# EAGLE design main_board (EAGLE 7.7.0)
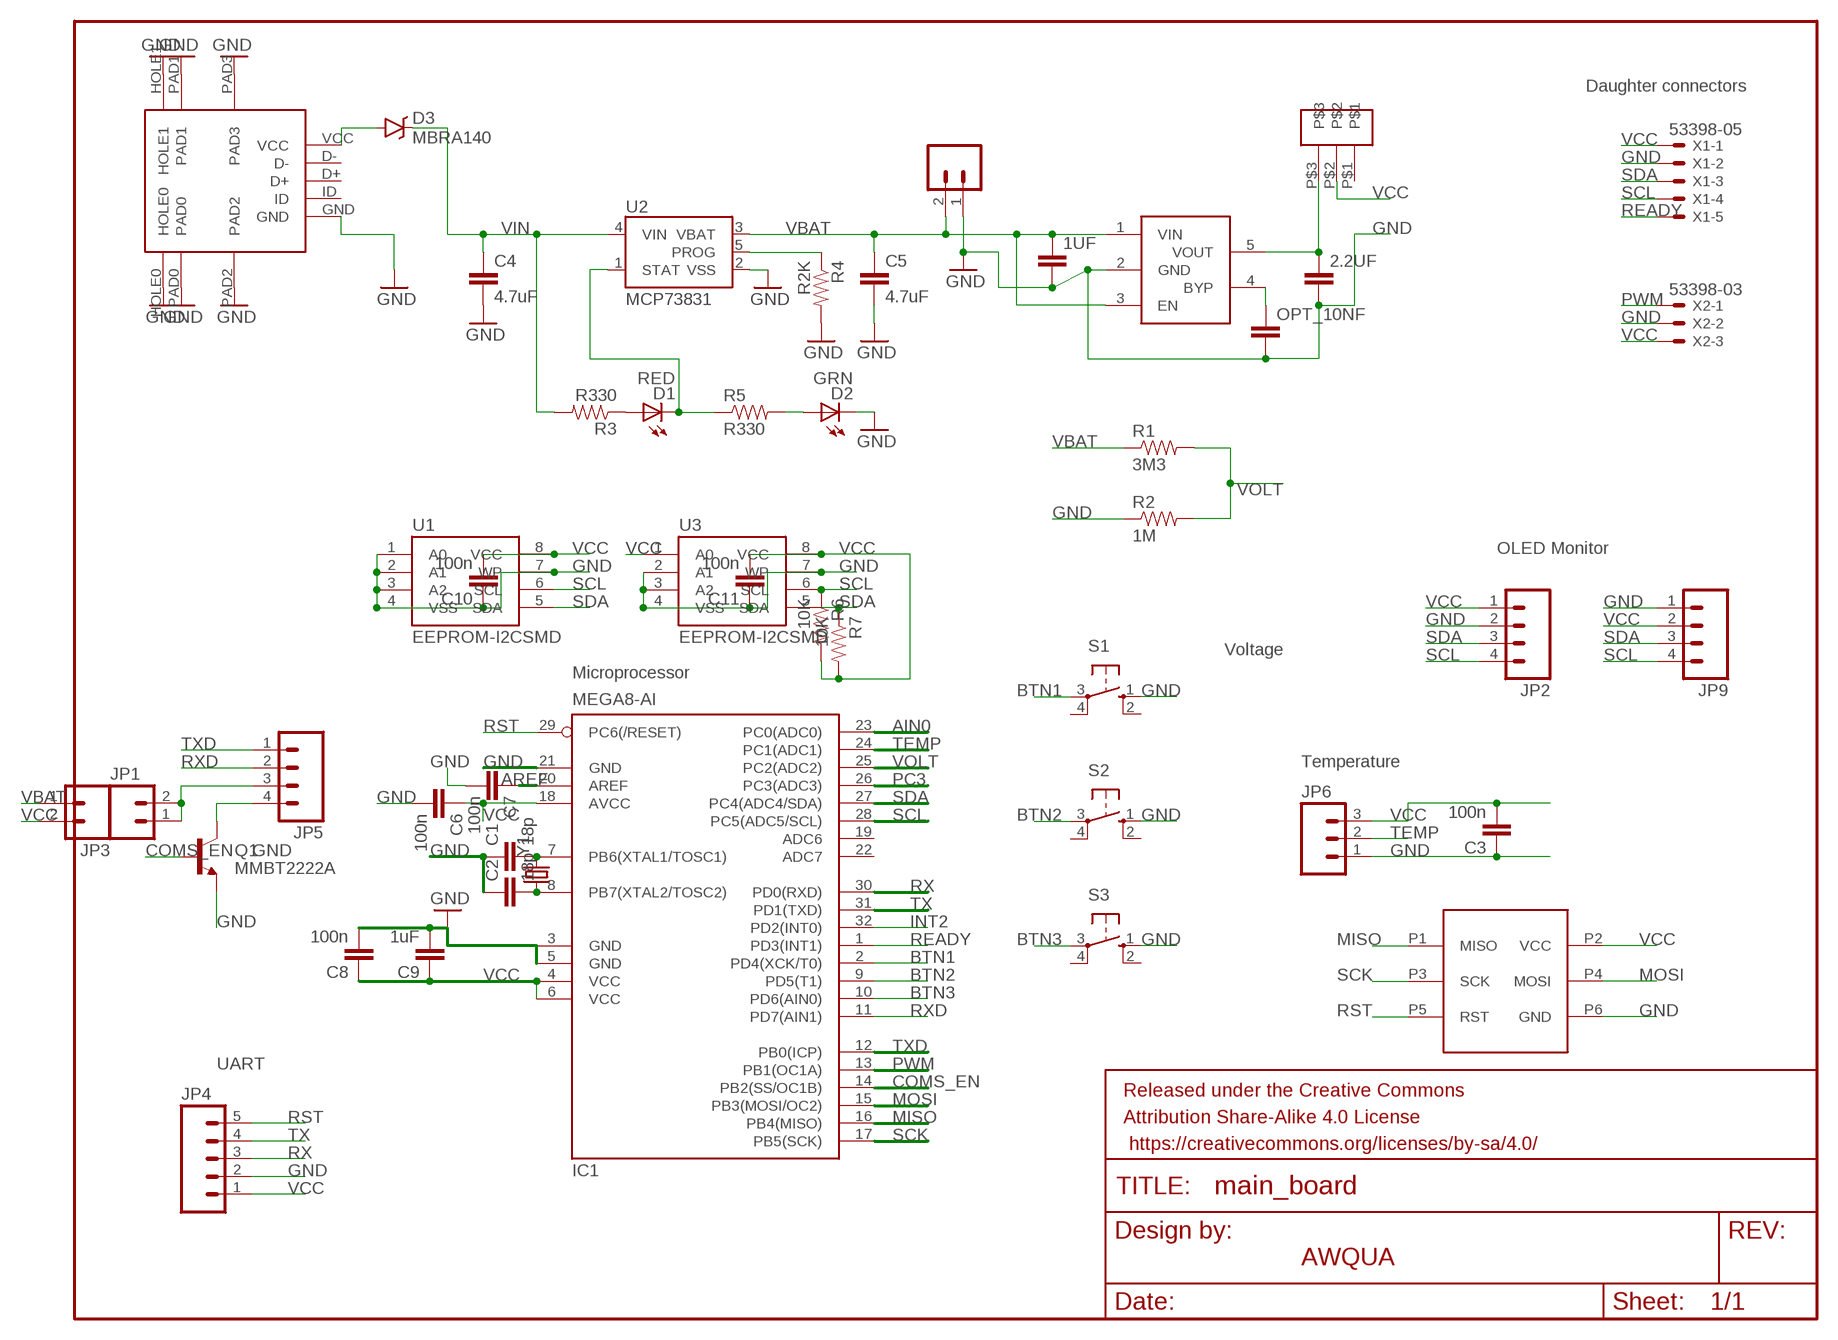
[diagram p0: schematic, sheet 1]

## Parts
1UF  CAP0603-CAP  [0603-CAP]
2.2UF  CAP0603-CAP  [0603-CAP]
C1  18p  CAP0603-CAP  [0603-CAP]
C2  18p  CAP0603-CAP  [0603-CAP]
C3  100n  CAP0603-CAP  [0603-CAP]
C4  4.7uF  CAP0402-CAP  [0402-CAP]
C5  4.7uF  CAP0402-CAP  [0402-CAP]
C6  100n  CAP0603-CAP  [0603-CAP]
C7  100n  CAP0603-CAP  [0603-CAP]
C8  100n  CAP0603-CAP  [0603-CAP]
C9  1uF  CAP0603-CAP  [0603-CAP]
C10  100n  CAP0603-CAP  [0603-CAP]
C11  100n  CAP0603-CAP  [0603-CAP]
D1  RED  LED0603  [LED-0603]
D2  GRN  LED0603  [LED-0603]
D3  MBRA140  [SMA-DIODE]
FRAME1  FRAME-LETTER  [CREATIVE_COMMONS]
IC1  MEGA8-AI  [TQFP32-08]
JP1  M02PTH  [1X02]
JP2  M04PTH  [1X04]
JP3  M02PTH  [1X02]
JP4  M05PTH  [1X05]
JP5  M04PTH  [1X04]
JP6  M03PTH  [1X03]
JP7  LiPo Battery  M02-JST-2MM-SMT  [JST-2-SMD]
JP9  M04PTH  [1X04]
OPT_10NF  CAP0603-CAP  [0603-CAP]
Q1  MMBT2222A  TRANSISTOR_NPNMMBT2222A  [SOT23-3]
R1  3M3  RESISTOR0603  [0603-RES]
R2  1M  RESISTOR0603  [0603-RES]
R3  R330  RESISTOR0402-RES  [0402-RES]
R4  R2K  RESISTOR0402-RES  [0402-RES]
R5  R330  RESISTOR0402-RES  [0402-RES]
R6  10K  RESISTOR0402-RES  [0402-RES]
R7  10K  RESISTOR0402-RES  [0402-RES]
S1  40-XX  [B3F-40XX]
S2  40-XX  [B3F-40XX]
S3  40-XX  [B3F-40XX]
U1  EEPROM-I2CSMD  [SO08]
U2  MCP73831  [SOT23-5]
U3  EEPROM-I2CSMD  [SO08]
U$1  ISP-SMD-6PIN  [ISP-SMD-6PIN]
U$2  OS102-SPDT-SWITCH  [OS102-SPDT-SWITCH]
U$3  USBMICRO-10118193-0001LF  [USBMICRO-10118193-0001LF]
U$6  LP2985  [LP2985]
X1  53398-05  [53398-05]
X2  53398-03  [53398-03]
Y1  CRYSTAL5X3  [CRYSTAL-SMD-5X3]

## Nets
AIN0: IC1.23(PC0(ADC0))
AREF: C7.1 IC1.20(AREF)
BTN1: IC1.2(PD4(XCK/T0)) S1.3(P)
BTN2: IC1.9(PD5(T1)) S2.3(P)
BTN3: IC1.10(PD6(AIN0)) S3.3(P)
COMS_EN: IC1.14(PB2(SS/OC1B)) Q1.1(B)
GND: 1UF.2 2.2UF.2 C1.1 C2.1 C3.1 C4.2 C5.2 C6.2 C7.2 C8.2 C9.2 C10.1 C11.1 D2.C IC1.3(GND) IC1.5(GND) IC1.21(GND) JP2.2 JP4.2 JP5.4 JP6.1 JP7.1 JP9.1 OPT_10NF.2 Q1.2(E) Q1.3(C) R2.1 R4.2 S1.1(S) S2.1(S) S3.1(S) U1.1(A0) U1.2(A1) U1.3(A2) U1.4(VSS) U1.7(WP) U2.2(VSS) U3.2(A1) U3.3(A2) U3.4(VSS) U3.7(WP) U$1.P6(GND) U$3.GND U$3.HOLE0 U$3.HOLE1 U$3.PAD0 U$3.PAD1 U$3.PAD2 U$3.PAD3 U$6.2(GND) X1.2 X2.2
INT2: IC1.32(PD2(INT0))
MISO: IC1.16(PB4(MISO)) U$1.P1(MISO)
MOSI: IC1.15(PB3(MOSI/OC2)) U$1.P4(MOSI)
N$1: D1.A R3.1
N$2: OPT_10NF.1 U$6.4(BYP)
N$3: JP1.1 JP1.2 JP5.3
N$4: 2.2UF.1 U$2.P$3 U$6.5(VOUT)
N$5: D2.A R5.2
PC3: IC1.26(PC3(ADC3))
PROG: R4.1 U2.5(PROG)
PWM: IC1.13(PB1(OC1A)) X2.1
Q1: C2.2 IC1.8(PB7(XTAL2/TOSC2)) Y1.1
Q2: C1.2 IC1.7(PB6(XTAL1/TOSC1)) Y1.3
READY: IC1.1(PD3(INT1)) X1.5
RST: IC1.29(PC6(/RESET)) JP4.5 U$1.P5(RST)
RX: IC1.30(PD0(RXD)) JP4.3
RXD: IC1.11(PD7(AIN1)) JP5.2
SCK: IC1.17(PB5(SCK)) U$1.P3(SCK)
SCL: IC1.28(PC5(ADC5/SCL)) JP2.4 JP9.4 R6.1 U1.6(SCL) U3.6(SCL) X1.4
SDA: IC1.27(PC4(ADC4/SDA)) JP2.3 JP9.3 R7.1 U1.5(SDA) U3.5(SDA) X1.3
STAT: D1.C R5.1 U2.1(STAT)
TEMP: IC1.24(PC1(ADC1)) JP6.2
TX: IC1.31(PD1(TXD)) JP4.4
TXD: IC1.12(PB0(ICP)) JP5.1
VBAT: 1UF.1 C5.1 JP3.1 JP7.2 R1.1 U2.3(VBAT) U$6.1(VIN) U$6.3(EN)
VBUS: D3.A U$3.VCC
VCC: C3.2 C6.1 C8.1 C9.1 C10.2 C11.2 IC1.4(VCC) IC1.6(VCC) IC1.18(AVCC) JP2.1 JP3.2 JP4.1 JP6.3 JP9.2 R6.2 R7.2 U1.8(VCC) U3.1(A0) U3.8(VCC) U$1.P2(VCC) U$2.P$2 X1.1 X2.3
VIN: C4.1 D3.C R3.2 U2.4(VIN)
VOLT: IC1.25(PC2(ADC2)) R1.2 R2.2
Unconnected: IC1.19(ADC6) IC1.22(ADC7) S1.2(S1) S1.4(P1) S2.2(S1) S2.4(P1) S3.2(S1) S3.4(P1) U$2.P$1 U$3.D+ U$3.D- U$3.ID

## Notes on the sheet
- Daughter connectors
- OLED Monitor
- Voltage
- Microprocessor
- Temperature
- UART
- AWQUA

## Library data of the parts
1UF 2.2UF OPT_10NF = SparkFun-Passives:CAP: Capacitor Standard 0603 ceramic capacitor, and 0.1" leaded capacitor.
C1-C11 = SparkFun:CAP: Capacitor Standard 0603 ceramic capacitor, and 0.1" leaded capacitor.
D1 D2 = SparkFun:LED: LEDs Standard schematic elements and footprints for 5mm, 3mm, 1206, and 0603 sized LEDs. 5mm - Spark Fun Electronics SKU : COM-00529 (and others)
D3 = SparkFun-DiscreteSemi:MBRA140: 40V, 1A Schottky rectifier SMA/DO-214AC package DIO-08053; PROD_ID: DIO-08053
FRAME1 = SparkFun-Aesthetics:FRAME-LETTER: Schematic Frame Standard 8.5x11 US Letter frame
IC1 = atmel:MEGA8: MICROCONTROLLER 8 Kbytes FLASH, 1 kbytes SRAM, 512 bytes EEPROM, USART, 6-channel 10 bit ADC, 2-channel 8 bit ADC Pin compatible with Atmega48, ATMega88, ATMega168 Source: avr.lbr; MPN: ATMEGA8-16AU; OC_FARNELL: 9171371; OC_NEWARK: 73M8863
JP1 JP3 = SparkFun-Connectors:M02: Standard 2-pin 0.1" header. Use with - straight break away headers ( PRT-00116) - right angle break away headers (PRT-00553) - swiss pins (PRT-00743) - machine pins (PRT-00117) - female headers (PRT-00115) Molex polarized connector foot print use with: PRT-08233 with associated crimp pins and housings. 2.54_SCREWTERM for use with PRT-10571. 3.5mm Screw Terminal footprints for PRT-08084 5mm Screw Terminal footprints for use with PRT-08432
JP2 JP5 JP9 = SparkFun-Connectors:M04: Header 4 Standard 4-pin 0.1" header. Use with straight break away headers (SKU : PRT-00116), right angle break away headers (PRT-00553), swiss pins (PRT-00743), machine pins (PRT-00117), and female headers (PRT-00115). Molex polarized connector foot print use with SKU : PRT-08231 with associated crimp pins and housings. 1MM SMD Version SKU: PRT-10208
JP4 = SparkFun-Connectors:M05: Header 5 Standard 5-pin 0.1" header. Use with straight break away headers (SKU : PRT-00116), right angle break away headers (PRT-00553), swiss pins (PRT-00743), machine pins (PRT-00117), and female headers (PRT-00115). Molex polarized connector foot print use with SKU : PRT-08230 with associated crimp pins and housings.
JP6 = SparkFun-Connectors:M03: Header 3 Standard 3-pin 0.1" header. Use with straight break away headers (SKU : PRT-00116), right angle break away headers (PRT-00553), swiss pins (PRT-00743), machine pins (PRT-00117), and female headers (PRT-00115). Molex polarized connector foot print use with SKU : PRT-08232 with associated crimp pins and housings.
JP7 = SparkFun:M02: Header 2 Standard 2-pin 0.1" header. Use with straight break away headers (SKU : PRT-00116), right angle break away headers (PRT-00553), swiss pins (PRT-00743), machine pins (PRT-00117), and female headers (PRT-00115). Molex polarized connector foot print use with SKU : PRT-08233 with associated crimp pins and housings.
Q1 = SparkFun-DiscreteSemi:TRANSISTOR_NPN: Generic NPN BJT MMBT2222A - TRANS-08049 (SOT-23, 1A 40V) MPSA42 - TRANS-09116 (SOT-23, 500mA 300V) MMBT5088LT1G - TRANS-11160 (SOT-23, 50 mA 30V) BC547 - COM-08928 <http://www.sparkfun.com/products/8928> (TO-92 45V 100mA) (1.Collector 2.Base 3.Emitter) 2N3904 - COM-00521 <http://www.sparkfun.com/products/521> (TO-92 40V 200mA) (1.Emitter 2.Base 3.Collector) P2N2222A - COM-12852 <http://www.sparkfun.com/products/12852> (TO-92 40V 600mA) (1.Collector 2.Base 3.Emitter); PROD_ID: TRANS-08049
R1 R2 = SparkFun-Resistors:RESISTOR: Resistor Basic schematic elements and footprints for 0603, 1206, and PTH resistors.
R3-R7 = SparkFun:RESISTOR: Resistor Basic schematic elements and footprints for 0603, 1206, and PTH resistors.
S1-S3 = adafruit:40-XX: OMRON SWITCH; MF: OMRON COMPONENTS USA; MPN: B3F-4000; OC_FARNELL: 176434; OC_NEWARK: 36K3105
U1 U3 = SparkFun-DigitalIC:EEPROM-I2C: I2C EEPROM chips, 24LC256 (and others)
U2 = SparkFun:MCP73831: Microchip's MCP73831 Miniature single cell, fully integrated Li-Ion, Li-polymer charge management controller http://ww1.microchip.com/downloads/en/DeviceDoc/21984a.pdf
U$1 = awqua_eagle_library:ISP-SMD-6PIN
U$2 = awqua_eagle_library:OS102-SPDT-SWITCH
U$3 = awqua_eagle_library:USBMICRO-10118193-0001LF
U$6 = awqua_eagle_library:LP2985
X1 = con-molex:53?-05: CONNECTOR wire to board 1.25 mm (.049 inch) pitch header; OC_FARNELL: 1125354; OC_NEWARK: unknown
X2 = con-molex:53?-03: CONNECTOR wire to board 1.25 mm (.049 inch) pitch header; OC_FARNELL: unknown; OC_NEWARK: unknown
Y1 = SparkFun:CRYSTAL: Crystals Various standard crystals. Proven footprints. Spark Fun Electronics SKU : COM-00534

## Board
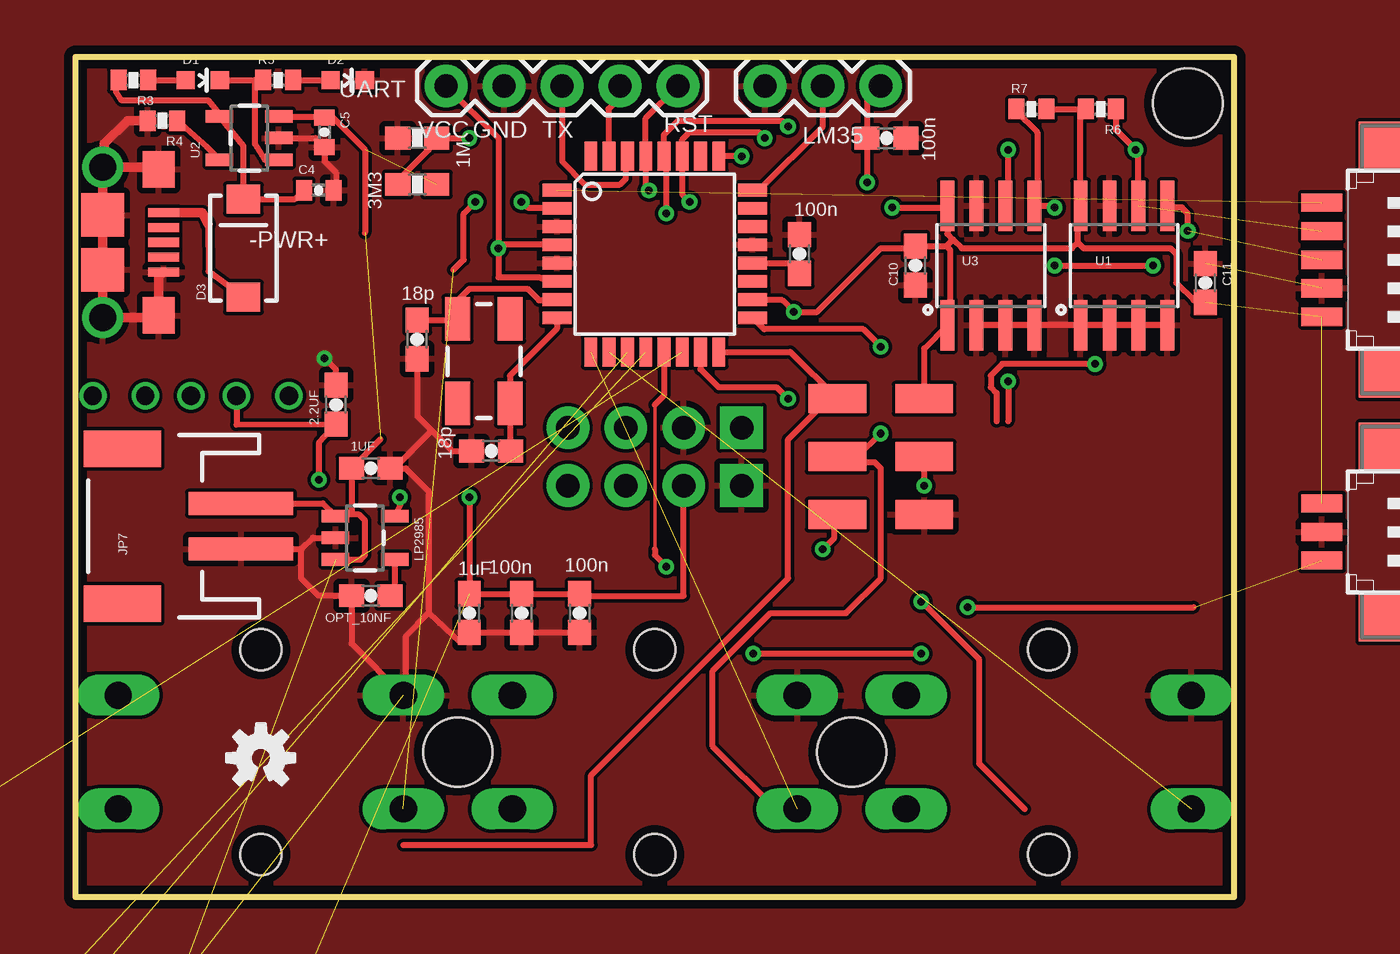
[diagram p1: board, top side]
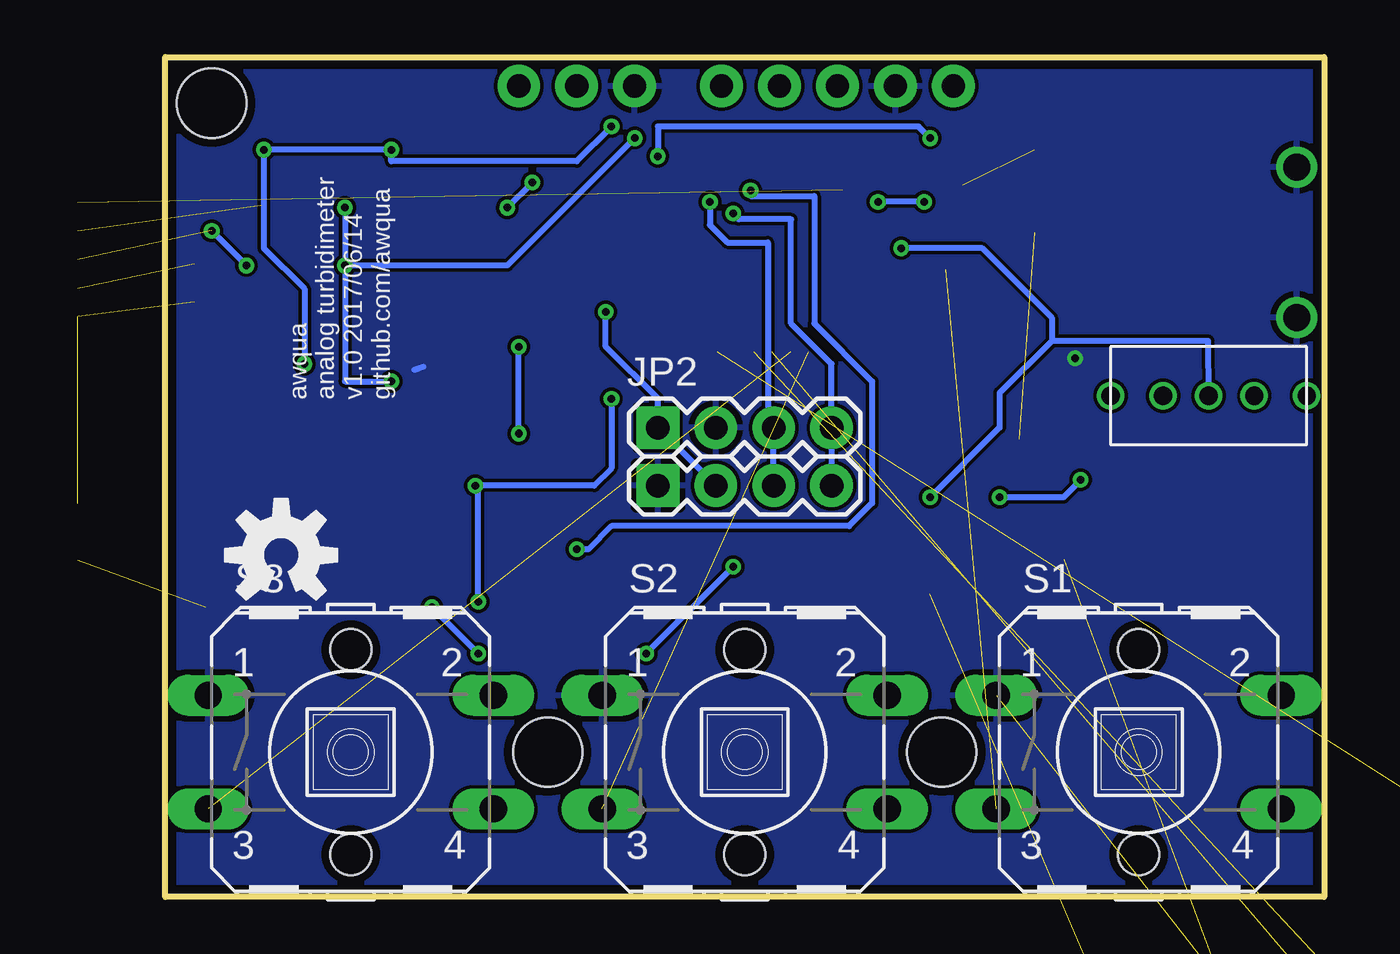
[diagram p2: board, bottom side, seen from below]

Size 50.8 x 36.83 mm. Coordinates in mm from the lower left corner, seen from the top.
Outline: 0,0 50.8,0 50.8,36.83 0,36.83 0,0
Copper layers (1*16): Top 0.0356mm / dielectric 1.5011mm / Bottom 0.0356mm
Design rules "default *": minimum track width 6mil, minimum drill 13mil, track to track 6mil, track to pad 6mil, pad to pad 6mil, via to via 6mil, smd to smd 6mil, copper to edge 15mil, drill to drill 6mil, minimum pad ring 7mil, minimum via ring 7mil, stop-mask expansion 4mil, vias tented up to drill 15mil, thermal gap 10mil
Holes 3.05 mm at 16.76,6.35 48.77,34.8 34.04,6.35

### Footprints (pad centres in the part's own frame; a part is rotated, then mirrored left to right if it is on the bottom)
0603-CAP = smd 1.1 x 1: 1 -0.85,0; 2 0.85,0
0402-CAP = smd 0.7 x 0.9: 1 -0.65,0; 2 0.65,0
LED-0603 = smd 0.8 x 0.8: A 0,-0.75; C 0,0.75
SMA-DIODE = smd 1.27 x 1.47: A -2.15,0; C 2.15,0
TQFP32-08 = smd 1.27 x 0.559: 1 -4.293,2.8; 2 -4.293,2; 3 -4.293,1.2; 4 -4.293,0.4; 5 -4.293,-0.4; 6 -4.293,-1.2; 7 -4.293,-2; 8 -4.293,-2.8; 17 4.293,-2.8; 18 4.293,-2; 19 4.293,-1.2; 20 4.293,-0.4; 21 4.293,0.4; 22 4.293,1.2; 23 4.293,2; 24 4.293,2.8 | smd 0.559 x 1.27: 9 -2.8,-4.293; 10 -2,-4.293; 11 -1.2,-4.293; 12 -0.4,-4.293; 13 0.4,-4.293; 14 1.2,-4.293; 15 2,-4.293; 16 2.8,-4.293; 25 2.8,4.293; 26 2,4.293; 27 1.2,4.293; 28 0.4,4.293; 29 -0.4,4.293; 30 -1.2,4.293; 31 -2,4.293; 32 -2.8,4.293
1X02 = drill 1.016 pad 1.88: 1 0,0; 2 2.54,0
1X04 = drill 1.016 pad 1.88 square: 1 0,0 | drill 1.016 pad 1.88: 2 2.54,0; 3 5.08,0; 4 7.62,0
1X05 = drill 1.016 pad 1.88: 1 0,0; 2 2.54,0; 3 5.08,0; 4 7.62,0; 5 10.16,0
1X03 = drill 1.016 pad 1.88: 1 0,0; 2 2.54,0; 3 5.08,0
JST-2-SMD = smd 1 x 4.6: 1 -1,-3.7; 2 1,-3.7 | smd 1.6 x 3.4: NC1 -3.4,1.5; NC2 3.4,1.5
SOT23-3 = smd 0.8 x 0.9: 1 -0.95,-1; 2 0.95,-1; 3 0,1.1
0603-RES = smd 1.1 x 1: 1 -0.85,0; 2 0.85,0
0402-RES = smd 0.7 x 0.9: 1 -0.65,0; 2 0.65,0
B3F-40XX = drill 1.194 long: 1 -6.248,2.489; 2 6.248,2.489; 3 -6.248,-2.489; 4 6.248,-2.489 | hole 1.803: 0,-4.496; 0,4.496
SO08 = smd 0.61 x 2.21: 1 -1.905,-2.616; 2 -0.635,-2.616; 3 0.635,-2.616; 4 1.905,-2.616; 5 1.905,2.616; 6 0.635,2.616; 7 -0.635,2.616; 8 -1.905,2.616
SOT23-5 = smd 0.55 x 1.2: 1 -0.95,-1.3; 2 0,-1.3; 3 0.95,-1.3; 4 0.95,1.3; 5 -0.95,1.3
ISP-SMD-6PIN = smd 1.27 x 2.54: P1 2.54,1.905; P2 2.54,-1.905; P3 0,1.905; P4 0,-1.905; P5 -2.54,1.905; P6 -2.54,-1.905
OS102-SPDT-SWITCH = drill 0.8: ANCHOR1 0,2.15; ANCHOR2 8.6,2.15; P$1 2.3,2.15; P$2 4.3,2.15; P$3 6.3,2.15
USBMICRO-10118193-0001LF = smd 0.4 x 1.35: D+ 0,4.125; D- -0.65,4.125; GND 1.3,4.125; ID 0.65,4.125; VCC -1.3,4.125 | drill 1.2 pad 1.6: HOLE0 3.3,1.45; HOLE1 -3.3,1.45 | smd 1.9 x 1.9: PAD0 1.2,1.45; PAD1 -1.2,1.45 | smd 1.6 x 1.4: PAD2 3.2,3.9; PAD3 -3.2,3.9
LP2985 = smd 0.55 x 1.2: 1 0.32,-0.03; 2 1.27,-0.03; 3 2.22,-0.03; 4 2.22,2.57; 5 0.32,2.57
53398-05 = smd 0.8 x 1.8: 1 2.5,-2.5; 2 1.25,-2.5; 3 0,-2.5; 4 -1.25,-2.5; 5 -2.5,-2.5 | smd 2.1 x 3: S1 5,0.625; S2 -5,0.625
53398-03 = smd 0.8 x 1.8: 1 1.25,-2.5; 2 0,-2.5; 3 -1.25,-2.5 | smd 2.1 x 3: S1 3.75,0.625; S2 -3.75,0.625
CRYSTAL-SMD-5X3 = smd 1.9 x 1.1: 1 -1.85,-1.15; 2 1.85,-1.15; 3 1.85,1.15; 4 -1.85,1.15

### Placement (x,y rotation side)
1UF  12.95,18.8 0 top
2.2UF  11.43,21.59 90 top
C1  14.99,24.45 90 top
C2  18.22,19.56 0 top
C3  35.56,33.27 180 top
C4  10.67,30.99 0 top
C5  10.92,33.53 270 top
C6  22.1,12.45 270 top
C7  31.75,28.19 90 top
C8  19.56,12.45 270 top
C9  17.27,12.45 270 top
C10  36.83,27.69 90 top
C11  49.53,26.92 270 top
D1  5.59,35.81 270 top
D2  11.94,35.81 270 top
D3  7.37,28.45 90 top
FRAME1  -0.64,-8.89 0 top  (outside the outline)
IC1  25.4,28.19 0 top
JP1  -15.24,-38.1 0 top  (outside the outline)
JP2  29.21,20.57 0 bottom
JP3  -15.24,-56.9 0 top  (outside the outline)
JP4  16.26,35.56 0 top
JP5  -15.24,-19.3 0 top  (outside the outline)
JP6  30.23,35.56 0 top
JP7  3.56,16.26 90 top
JP9  29.21,18.03 0 bottom
OPT_10NF  12.95,13.21 180 top
Q1  -23.11,-7.37 0 top  (outside the outline)
R1  14.99,31.24 180 top
R2  14.99,33.27 0 top
R3  2.54,35.81 180 top
R4  3.81,34.04 180 top
R5  8.89,35.81 0 top
R6  44.96,34.54 180 top
R7  41.91,34.54 0 top
S1  8.13,6.35 0 bottom
S2  25.4,6.35 0 bottom
S3  42.67,6.35 0 bottom
U1  45.97,27.69 0 top
U2  7.62,33.27 90 top
U3  40.13,27.69 0 top
U$1  35.31,19.3 90 top
U$2  0.76,24.13 180 bottom
U$3  -0.25,28.7 270 top
U$4  [OSHW-LOGO-M]  45.72,14.99 0 bottom
U$5  [OSHW-LOGO-S]  8.13,6.1 0 top
U$6  11.43,17.02 270 top
X1  57.15,27.94 270 top  (outside the outline)
X2  57.15,16 270 top  (outside the outline)
Y1  17.91,23.5 90 top

### Tracks (layer width: path | path; a pad name or v marks a point on that pad's centre or on a via)
AREF
  Top 0.254: IC1.20 31.3,27.79 C7.1
BTN1  (via drill 0.33)  (1 unrouted)
  Top 0.254: 16.58,27.5 17.02,27.94 17.02,29.97 v17.53,30.48 | v19.56,30.48 19.81,30.23 21.07,30.23 IC1.2
  Bottom 0.254: v17.53,30.48 v19.56,30.48
BTN2  (1 unrouted)
BTN3  (1 unrouted)
COMS_EN  (1 unrouted)
GND  (via drill 0.33)  (4 unrouted)
  Top 0.254: U2.2 10.53,33.27 C5.2 | 11.06,33.02 C5.2 | C5.2 10.92,32.26 11.43,31.75 11.43,31.1 C4.2 | 9.92,15.26 JP7.1 7.24,15.24 | 9.92,15.26 10.41,15.75 U$6.2 | 9.92,15.26 9.91,15.24 9.91,13.97 10.67,13.21 OPT_10NF.2 12.1,11.11 S1.1 14.48,8.94 14.48,11.43 15.49,12.45 | C1.1 14.99,21.08 15.62,20.45 | 15.62,20.45 16.51,19.56 C2.1 | 15.62,20.45 13.97,18.8 1UF.2 14.48,18.8 15.49,17.78 15.49,12.45 | U1.4 U1.3 U1.2 U1.1 U3.4 U3.3 U3.2 | 15.49,12.45 16.85,11.18 C9.2 C8.2 C6.2 | 2.2UF.2 11.43,23.11 v10.92,23.62
  Top 0.406: R4.2 2.29,34.04 1.27,33.02 1.27,32.08 U$3.HOLE1 | U$3.HOLE1 3.55,32 U$3.PAD3 | U$3.HOLE1 U$3.PAD1 U$3.PAD0 U$3.HOLE0 3.55,25.4 U$3.PAD2 3.65,27.18 U$3.GND
  Bottom 0.254: 39.5,23.24 39.88,23.11
  pour Top: 60.45,-4.32 -6.6,-3.56 -7.37,39.88 60.45,41.15
  pour Bottom: -5.08,39.12 53.85,39.62 52.58,-7.62 -6.1,-6.86
MISO
  Top 0.254: IC1.16 31.34,23.9 U$1.P1 33.15,21.59 32.77,21.59 31.24,20.07 31.24,13.97 22.61,5.33 22.61,2.29 14.38,2.29
MOSI  (via drill 0.33)
  Top 0.254: IC1.15 27.4,23.15 28.19,22.35 30.73,22.35 v31.24,21.84 | v37.21,18.03 U$1.P4 | 41.6,3.86 39.62,5.84 39.62,10.41 v37.08,12.95
  Bottom 0.254: v31.24,21.84 31.24,18.8 32,18.03 v37.21,18.03 37.08,17.91 v37.08,12.95
N$1
  Top 0.254: R3.1 D1.A
N$2
  Top 0.254: U$6.4 14,13.4 OPT_10NF.1
N$3  (2 unrouted)
N$4  (via drill 0.33)
  Top 0.254: U$2.P$3 7.06,20.71 2.2UF.1 10.67,19.9 v10.67,18.29 | v14.22,17.53 14.22,17.18 U$6.5
  Bottom 0.254: v10.67,18.29 11.43,17.53 v14.22,17.53
N$5
  Top 0.254: R5.2 D2.A
PROG
  Top 0.254: R4.1 5.77,32.88 U2.5
PWM  (via drill 0.33)  (1 unrouted)
  Top 0.152: 25.4,21.59 25.4,15.24
  Top 0.254: IC1.13 25.8,21.99 25.4,21.59 | 25.4,15.24 25.4,14.99 v25.91,14.48 | v29.72,10.67 v37.08,10.67 | v39.12,12.7 49.02,12.7
  Bottom 0.254: v25.91,14.48 v29.72,10.67 | v37.08,10.67 v39.12,12.7
Q1
  Top 0.254: IC1.8 21.11,24.92 19.05,22.86 19.05,21.65 Y1.1 19.06,19.58 C2.2
Q2
  Top 0.254: C1.2 16.71,25.3 Y1.3 16.76,26.16 17.27,26.67 19.81,26.67 20.32,26.16 21.07,26.16 IC1.7
READY  (1 unrouted)
RST  (via drill 0.33)
  Top 0.254: JP4.5 25,34.14 IC1.29 25,31.13 v25.15,30.99 | v32.77,15.24 33.27,15.75 33.27,16.64 U$1.P5
  Bottom 0.254: v25.15,30.99 25.15,30.73 22.35,30.73 22.35,25.15 19.81,22.61 19.81,17.27 20.83,16.26 31.24,16.26 32.26,15.24 v32.77,15.24
RX
  Top 0.254: JP4.3 21.34,32.26 22.35,31.24 23.88,31.24 24.13,31.5 24.13,32.42 IC1.30
RXD  (1 unrouted)
SCK  (via drill 0.33)
  Top 0.254: v35.31,20.32 34.29,19.3 U$1.P3 33.66,19.05 35.05,19.05 35.31,18.8 35.31,13.97 33.78,12.45 30.48,12.45 27.94,9.91 27.94,6.6 30.68,3.86 | v35.31,24.13 34.54,24.89 30.2,24.89 IC1.17
  Bottom 0.254: v35.31,20.32 v35.31,24.13
SCL  (via drill 0.33)  (1 unrouted)
  Top 0.254: v40.89,32.77 40.89,31.24 40.77,30.86 U3.6 40.64,30.18 | 46.48,30.43 U1.6 46.61,32.64 v46.48,32.77 45.61,33.64 R6.1 | v31.24,33.78 30.99,34.04 26.42,34.04 25.8,33.42 IC1.28 25.91,32.38 v25.91,29.97 | v44.7,23.37 40.64,23.37 40.13,22.86 40.13,22.35 40.39,22.1 40.39,20.86
  Bottom 0.254: v31.24,33.78 32.77,32.26 40.89,32.26 v40.89,32.77 v46.48,32.77 46.48,28.45 44.7,26.67 v44.7,23.37 | v25.91,29.97 25.65,29.72 23.37,29.72 23.37,25.15 21.59,23.37 JP2.4 JP9.4
SDA  (via drill 0.33)  (1 unrouted)
  Top 0.254: v42.93,30.23 42.85,30.3 U3.5 42.16,30.43 42.16,33.53 41.26,34.43 R7.1 | v42.93,27.69 v47.24,27.69 | v48.77,29.21 48.77,29.97 48.51,30.23 47.95,30.23 U1.5 | v30.23,33.27 29.97,33.53 26.92,33.53 26.6,33.2 IC1.27 26.6,30.8 v26.92,30.48 | v40.89,22.61 40.89,20.85
  Bottom 0.254: v47.24,27.69 v48.77,29.21 | v30.23,33.27 35.81,27.69 v42.93,27.69 | v26.92,30.48 26.92,29.46 26.16,28.7 24.38,28.7 24.38,20.57 JP2.3 JP9.3 | v42.93,27.69 42.93,22.61 v40.89,22.61 | v42.93,30.23 v42.93,27.69
STAT
  Top 0.254: D1.C 7.87,35.81 | 7.87,35.81 R5.1 | U2.1 8.32,32.32 7.87,33.02 7.87,35.81
TEMP
  Top 0.254: IC1.24 29.98,30.99 32.77,33.78 JP6.2
TX
  Top 0.254: JP4.4 23.88,35.05 23.37,34.54 23.37,32.52 IC1.31
TXD  (1 unrouted)
VBAT  (3 unrouted)
  Top 0.254: U2.3 10.88,34.22 C5.1 11.29,34.18 12.7,32.77 12.7,29.13 | JP7.2 10.84,17.26 U$6.1 11.47,16.76 11.94,16.76 | U$6.3 12.51,14.8 12.7,14.99 12.7,16.51 12.45,16.76 11.94,16.76 | 13.38,20.07 1UF.1 12.1,16.93 11.94,16.76
VBUS
  Top 0.254: 5.81,29.49 5.84,27.43 D3.A
  Top 0.406: U$3.VCC 5.56,30 5.81,29.49
VCC  (via drill 0.33)  (3 unrouted)
  Top 0.254: JP6.3 34.71,35.05 C3.2 v34.71,31.33 | 38.48,28.83 38.23,29.08 U3.8 38.05,30.23 v35.81,30.23 | 38.48,28.83 38.86,28.45 43.69,28.45 43.94,28.7 | 43.94,28.7 43.94,30.18 U1.8 44.07,34.42 44.2,34.54 | 43.94,28.7 44.2,28.45 48.01,28.45 48.26,28.19 48.26,26.92 49.02,26.16 49.44,26.16 C11.2 | IC1.4 18.69,28.59 v18.54,28.45 | v18.54,28.45 18.54,27.18 20.32,27.18 21.04,26.92 IC1.6 | JP4.1 18.54,33.27 v18.54,28.45 | 38.19,28.54 C10.2 36.74,28.45 35.31,28.45 32.51,25.65 v31.5,25.65 30.99,26.16 29.73,26.16 IC1.18 | 38.19,28.54 38.48,28.83 | 38.19,28.54 38.35,28.37 38.35,25.2 U3.1 37.21,24.05 U$1.P2 | v17.27,17.53 C9.1 C8.1 C6.1 22.35,13.3 22.35,13.21 26.67,13.21 JP9.2 | R7.2 44.2,34.54 | 44.2,34.54 R6.2
  Bottom 0.254: JP9.2 JP2.1 29.21,21.84 31.5,24.13 v31.5,25.65 | v34.71,31.33 v35.81,30.23 | U$2.P$2 5.08,24.38 11.94,24.38 | v18.54,28.45 14.99,28.45 11.94,25.4 11.94,24.38 | 11.94,24.38 14.22,22.1 14.22,20.57 v17.27,17.53
VIN
  Top 0.254: R3.2 1.78,35.7 1.78,35.31 2.03,34.92 5.84,34.92 6.32,34.32 U2.4 7.37,32.92 D3.C 9.63,30.6 C4.1
VOLT  (via drill 0.33)
  Top 0.254: R1.2 14.14,31.41 15.49,32.77 15.49,32.93 R2.2 v17.27,33.27 | v29.21,32.48 IC1.25
  Bottom 0.254: v17.27,33.27 17.78,33.78 29.21,33.78 v29.21,32.48

### Text on the board
bPlace: awqua / analog turbidimeter / v1.0 2017/06/14 / github.com/awqua
tNames: UART | VCC | GND | TX | RST | LM35 | -PWR+ | AWQUA / Chris Kelley